# EAGLE design Main (EAGLE 9.6.2)
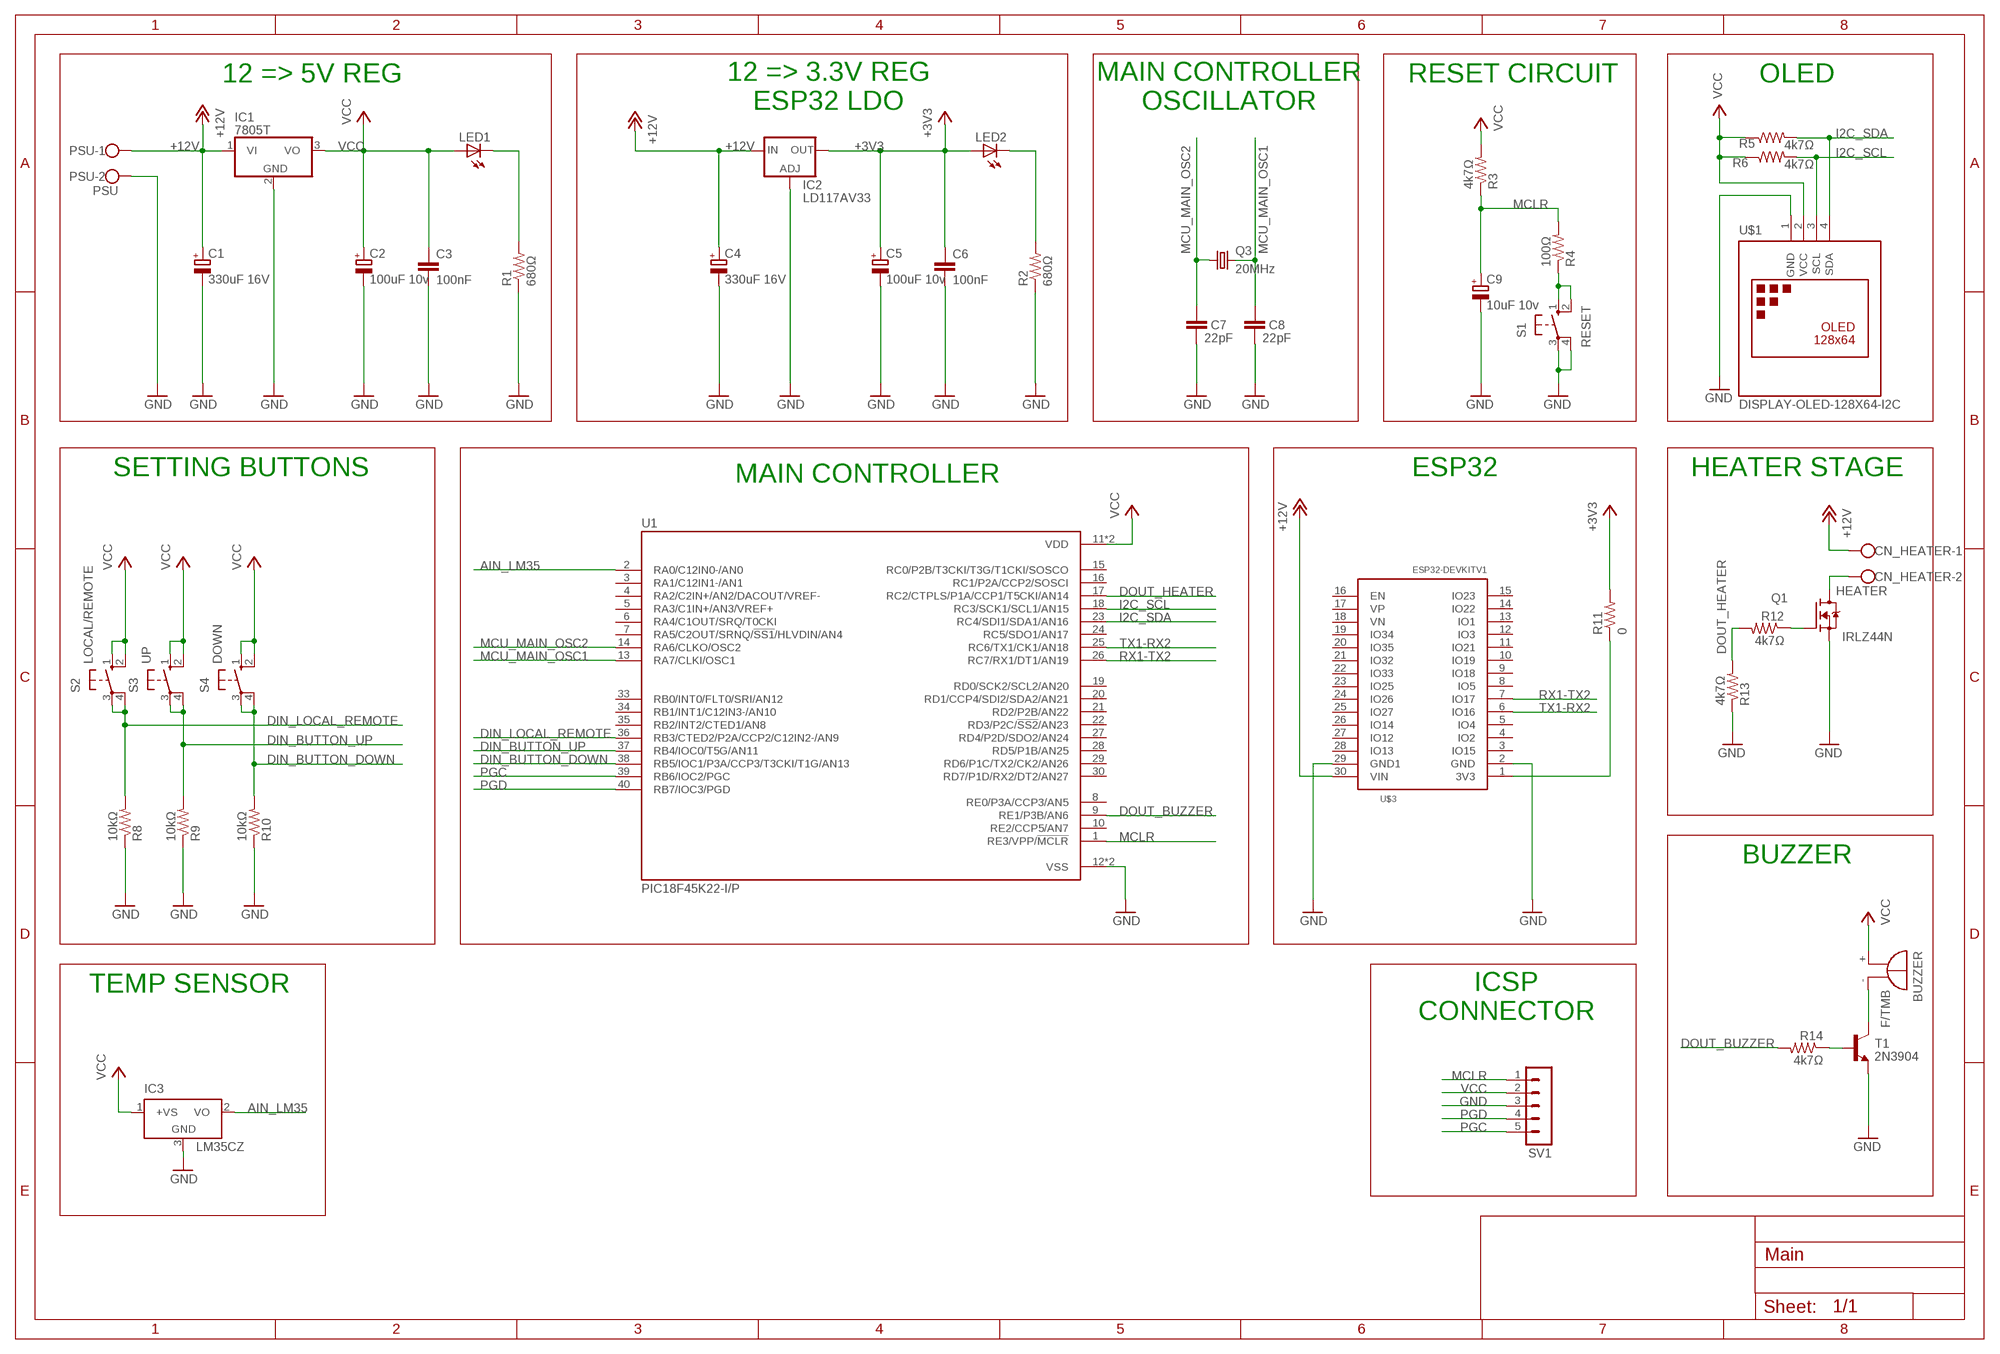
[diagram p0: schematic, sheet 1]

## Parts
BUZZER  F/TMB  [F/TMB]
C1  330uF 16V  CPOL-EUE2-5  [E2-5]
C2  100uF 10v  CPOL-EUE2-5  [E2-5]
C3  100nF  C-EU025-060X050  [C025-060X050]
C4  330uF 16V  CPOL-EUE2-5  [E2-5]
C5  100uF 10v  CPOL-EUE2-5  [E2-5]
C6  100nF  C-EU025-060X050  [C025-060X050]
C7  22pF  C-EU025-024X044  [C025-024X044]
C8  22pF  C-EU025-024X044  [C025-024X044]
C9  10uF 10v  CPOL-EUE2-5  [E2-5]
CN_HEATER  HEATER  W237-102  [W237-102]
IC1  7805T  [TO220H]
IC2  LD117AV33  [TO220L1]
IC3  LM35CZ  [TO92]
LED1  LED5MM  [LED5MM]
LED2  LED5MM  [LED5MM]
PSU  PSU  W237-102  [W237-102]
Q1  IRLZ44N  [TO254P1054X469X1930-3]
Q3  20MHz  CRYSTALHC49S  [HC49/S]
R1  680Ω  R-US_0204/7  [0204/7]
R2  680Ω  R-US_0204/7  [0204/7]
R3  4k7Ω  R-US_0204/7  [0204/7]
R4  100Ω  R-US_0204/7  [0204/7]
R5  4k7Ω  R-US_0204/7  [0204/7]
R6  4k7Ω  R-US_0204/7  [0204/7]
R8  10kΩ  R-US_0204/7  [0204/7]
R9  10kΩ  R-US_0204/7  [0204/7]
R10  10kΩ  R-US_0204/7  [0204/7]
R11  0  R-US_0204/7  [0204/7]
R12  4k7Ω  R-US_0204/7  [0204/7]
R13  4k7Ω  R-US_0204/7  [0204/7]
R14  4k7Ω  R-US_0204/7  [0204/7]
S1  RESET  10-XX  [B3F-10XX]
S2  LOCAL/REMOTE  10-XX  [B3F-10XX]
S3  UP  10-XX  [B3F-10XX]
S4  DOWN  10-XX  [B3F-10XX]
SV1  MA05-1  [MA05-1]
T1  2N3904  [TO92]
U1  PIC18F45K22-I/P  [DIP1543W47P254L5321H635Q40]
U$1  DISPLAY-OLED-128X64-I2C  [DISPLAY-OLED-128X64-I2C]
U$3  ESP32DEVKITV1  [ESP32-DEVKITV1]

## Nets
+3V3: C5.+ C6.1 IC2.2(OUT) LED2.A R11.2
+12V: C1.+ C4.+ CN_HEATER.1 IC1.1(VI) IC2.3(IN) PSU.1 U$3.30(VIN)
AIN_LM35: IC3.2(VO) U1.2(RA0/C12IN0-/AN0)
DIN_BUTTON_DOWN: R10.2 S4.3(P) S4.4(P1) U1.38(RB5/IOC1/P3A/CCP3/T3CKI/T1G/AN13)
DIN_BUTTON_UP: R9.2 S3.3(P) S3.4(P1) U1.37(RB4/IOC0/T5G/AN11)
DIN_LOCAL_REMOTE: R8.2 S2.3(P) S2.4(P1) U1.36(RB3/CTED2/P2A/CCP2/C12IN2-/AN9)
DOUT_BUZZER: R14.2 U1.9(RE1/P3B/AN6)
DOUT_HEATER: R12.2 R13.2 U1.17(RC2/CTPLS/P1A/CCP1/T5CKI/AN14)
GND: C1.- C2.- C3.2 C4.- C5.- C6.2 C7.2 C8.2 C9.- IC1.2(GND) IC2.1(ADJ) IC3.3(GND) PSU.2 Q1.3(S) R1.1 R2.1 R8.1 R9.1 R10.1 R13.1 S1.3(P) S1.4(P1) SV1.3 T1.3(E) U1.12(VSS) U1.31(VSS) U$1.1(GND) U$3.2(GND) U$3.29(GND1)
I2C_SCL: R6.2 U1.18(RC3/SCK1/SCL1/AN15) U$1.3(SCL)
I2C_SDA: R5.2 U1.23(RC4/SDI1/SDA1/AN16) U$1.4(SDA)
MCLR: C9.+ R3.1 R4.2 SV1.1 U1.1(RE3/VPP/!MCLR!)
MCU_MAIN_OSC1: C8.1 Q3.2 U1.13(RA7/CLKI/OSC1)
MCU_MAIN_OSC2: C7.1 Q3.1 U1.14(RA6/CLKO/OSC2)
N$1: LED2.K(C) R2.2
N$2: R11.1 U$3.1(3V3)
N$3: LED1.K(C) R1.2
N$6: R4.1 S1.1(S) S1.2(S1)
N$25: R14.1 T1.2(B)
N$26: BUZZER.- T1.1(C)
N$28: Q1.1(G) R12.1
N$29: CN_HEATER.2 Q1.2(D)
PGC: SV1.5 U1.39(RB6/IOC2/PGC)
PGD: SV1.4 U1.40(RB7/IOC3/PGD)
RX1-TX2: U1.26(RC7/RX1/DT1/AN19) U$3.7(IO17)
TX1-RX2: U1.25(RC6/TX1/CK1/AN18) U$3.6(IO16)
VCC: BUZZER.+ C2.+ C3.1 IC1.3(VO) IC3.1(+VS) LED1.A R3.2 R5.1 R6.1 S2.1(S) S2.2(S1) S3.1(S) S3.2(S1) S4.1(S) S4.2(S1) SV1.2 U1.11(VDD) U1.32(VDD) U$1.2(VCC)
Unconnected: U1.3(RA1/C12IN1-/AN1) U1.4(RA2/C2IN+/AN2/DACOUT/VREF-) U1.5(RA3/C1IN+/AN3/VREF+) U1.6(RA4/C1OUT/SRQ/T0CKI) U1.7(RA5/C2OUT/SRNQ/!SS1!/HLVDIN/AN4) U1.8(RE0/P3A/CCP3/AN5) U1.10(RE2/CCP5/AN7) U1.15(RC0/P2B/T3CKI/T3G/T1CKI/SOSCO) U1.16(RC1/P2A/CCP2/SOSCI) U1.19(RD0/SCK2/SCL2/AN20) U1.20(RD1/CCP4/SDI2/SDA2/AN21) U1.21(RD2/P2B/AN22) U1.22(RD3/P2C/!SS2!/AN23) U1.24(RC5/SDO1/AN17) U1.27(RD4/P2D/SDO2/AN24) U1.28(RD5/P1B/AN25) U1.29(RD6/P1C/TX2/CK2/AN26) U1.30(RD7/P1D/RX2/DT2/AN27) U1.33(RB0/INT0/FLT0/SRI/AN12) U1.34(RB1/INT1/C12IN3-/AN10) U1.35(RB2/INT2/CTED1/AN8) U$3.3(IO15) U$3.4(IO2) U$3.5(IO4) U$3.8(IO5) U$3.9(IO18) U$3.10(IO19) U$3.11(IO21) U$3.12(IO3) U$3.13(IO1) U$3.14(IO22) U$3.15(IO23) U$3.16(EN) U$3.17(VP) U$3.18(VN) U$3.19(IO34) U$3.20(IO35) U$3.21(IO32) U$3.22(IO33) U$3.23(IO25) U$3.24(IO26) U$3.25(IO27) U$3.26(IO14) U$3.27(IO12) U$3.28(IO13)

## Notes on the sheet
- 12 => 5V REG | RESET CIRCUIT | OLED
- 12 => 3.3V REG
  ESP32 LDO
- MAIN CONTROLLER
  OSCILLATOR
- SETTING BUTTONS | MAIN CONTROLLER | ESP32 | HEATER STAGE
- BUZZER
- TEMP SENSOR
- ICSP
  CONNECTOR

## Library data of the parts
BUZZER = buzzer:F/TMB: BUZZER Source: Buerklin; OC_FARNELL: unknown; OC_NEWARK: unknown
C1 C2 C4 C5 C9 = resistor:CPOL-EU: POLARIZED CAPACITOR, European symbol
C3 C6-C8 = resistor:C-EU: CAPACITOR, European symbol
CN_HEATER PSU = con-wago-500:W237-102: WAGO SCREW CLAMP; MPN: 237-102; OC_FARNELL: unknown; OC_NEWARK: 70K9898
IC1 = adafruit:78*: Positive VOLTAGE REGULATOR Added bigger pads to the TO-92 package
IC2 = v-reg:LD117A?*: Low drop fixed and adjustable positive voltage regulators 1 A Source: http://www.st.com/stonline/products/literature/ds/7194/ld1117axx.pdf
IC3 = lm35:LM35: Single-Supply Centigrade Temperature Sensor Vout = (10mV/°C x Temp °C) +5mmmV Source: http://www.national.com/ds/LM/LM35.pdf
LED1 LED2 = led:LED: LED OSRAM: - CHIPLED LG R971, LG N971, LY N971, LG Q971, LY Q971, LO R971, LY R971 LH N974, LH R974 LS Q976, LO Q976, LY Q976 LO Q996 - Hyper CHIPLED LW Q18S LB Q993, LB Q99A, LB R99A - SideLED LS A670, LO A670, LY A670, LG A670, LP A670 LB A673, LV A673, LT A673, LW A673 LH A674 LY A675 LS A676, LA A676, LO A676, LY A676, LW A676 LS A679, LY A679, LG A679 - Hyper Micro SIDELED® LS Y876, LA Y876, LO Y876, LY Y876 LT Y87S - SmartLED LW L88C, LW L88S LB L89C, LB L89S, LG L890 LS L89K, LO L89K, LY L89K LS L896, LA L896, LO L896, LY L896 - TOPLED LS T670, LO T670, LY T670, LG T670, LP T670 LSG T670, LSP T670, LSY T670, LOP T670, LYG T670 LG T671, LOG T671, LSG T671 LB T673, LV T673, LT T673, LW T673 LH T674 LS T676, LA T676, LO T676, LY T676, LB T676, LH T676, LSB T676, LW T676 LB T67C, LV T67C, LT T67C, LS T67K, LO T67K, LY T67K, LW E67C LS E67B, LA E67B, LO E67B, LY E67B, LB E67C, LV E67C, LT E67C LW T67C LS T679, LY T679, LG T679 LS T770, LO T770, LY T770, LG T770, LP T770 LB T773, LV T773, LT T773, LW T773 LH T774 LS E675, LA E675, LY E675, LS T675 LS T776, LA T776, LO T776, LY T776, LB T776 LHGB T686 LT T68C, LB T68C - Hyper Mini TOPLED® LB M676 - Mini TOPLED Santana® LG M470 LS M47K, LO M47K, LY M47K Source: http://www.osram.convergy.de LUXEON: - LUMILED® LXK2-PW12-R00, LXK2-PW12-S00, LXK2-PW14-U00, LXK2-PW14-V00 LXK2-PM12-R00, LXK2-PM12-S00, LXK2-PM14-U00 LXK2-PE12-Q00, LXK2-PE12-R00, LXK2-PE12-S00, LXK2-PE14-T00, LXK2-PE14-U00 LXK2-PB12-K00, LXK2-PB12-L00, LXK2-PB12-M00, LXK2-PB14-N00, LXK2-PB14-P00, LXK2-PB14-Q00 LXK2-PR12-L00, LXK2-PR12-M00, LXK2-PR14-Q00, LXK2-PR14-R00 LXK2-PD12-Q00, LXK2-PD12-R00, LXK2-PD12-S00 LXK2-PH12-R00, LXK2-PH12-S00 LXK2-PL12-P00, LXK2-PL12-Q00, LXK2-PL12-R00 Source: www.luxeon.com KINGBRIGHT: KA-3528ASYC Source: www.kingbright.com
Q1 = IRLZ44N:IRLZ44N: 55V Single N-Channel HEXFET Power MOSFET in a TO-220AB package Check availability <https://pricing.snapeda.com/parts/IRLZ44N/Infineon%20/%20IR/view-part?ref=eda>; AVAILABILITY: In Stock; CHECK_PRICES: https://www.snapeda.com/parts/IRLZ44N/Infineon/view-part/?ref=eda; DESCRIPTION: N-Channel 55 V 47A (Tc) 3.8W (Ta), 110W (Tc) Surface Mount D2PAK; MF: Infineon / IR; MP: IRLZ44N; PACKAGE: TO-220-3 Infineon / IR; PRICE: None; PURCHASE-URL: https://www.snapeda.com/api/url_track_click_mouser/?unipart_id=4479377&manufacturer=Infineon / IR&part_name=IRLZ44N&search_term=None; SNAPEDA_LINK: https://www.snapeda.com/parts/IRLZ44N/Infineon/view-part/?ref=snap
Q3 = crystal:CRYSTAL: CRYSTAL; OC_FARNELL: 1667008; OC_NEWARK: unknown
R1-R6 R8-R14 = resistor:R-US_: RESISTOR, American symbol
S1-S4 = switch-omron:10-XX: OMRON SWITCH; MPN: B3F-1000; OC_FARNELL: 176432; OC_NEWARK: 36M3542
SV1 = con-lstb:MA05-1: PIN HEADER; OC_FARNELL: unknown; OC_NEWARK: unknown
T1 = transistor:2N3904: NPN TRANSISTOR
U1 = PIC18F45K22-I_P:PIC18F45K22-I/P: Check availability <https://pricing.snapeda.com/parts/PIC18F45K22-I/P/Microchip/view-part?ref=eda>; AVAILABILITY: In Stock; CHECK_PRICES: https://www.snapeda.com/parts/PIC18F45K22-I/P/Microchip/view-part/?ref=eda; DESCRIPTION: PDIP-40 .600in TUBE, 32KB, Flash, 1536bytes-RAM,8-Bit nanoWatt XLP | Microchip Technology Inc. PIC18F45K22-I/P; MF: Microchip; MP: PIC18F45K22-I/P; PACKAGE: DIP-40 Microchip; PRICE: None; PURCHASE-URL: https://www.snapeda.com/api/url_track_click_mouser/?unipart_id=228946&manufacturer=Microchip&part_name=PIC18F45K22-I/P&search_term=None; SNAPEDA_LINK: https://www.snapeda.com/parts/PIC18F45K22-I/P/Microchip/view-part/?ref=snap
U$1 = diy-modules (2):DISPLAY-OLED-128X64-I2C: 128x64 Dot Matrix OLED Module based on SSD1306 chip Variant with I2C interface More details available here: http://www.instructables.com/id/Monochrome-096-i2c-OLED-display-with-arduino-SSD13/ SSD1306 datasheet: https://cdn-shop.adafruit.com/datasheets/SSD1306.pdf Click here to find device on ebay.com <http://www.ebay.com/sch/oled+display+128x64+iic> Note: There are two variants: I2C and SPI. Search for the proper version.
U$3 = ESP32-DEVKITV1:ESP32DEVKITV1

## Board
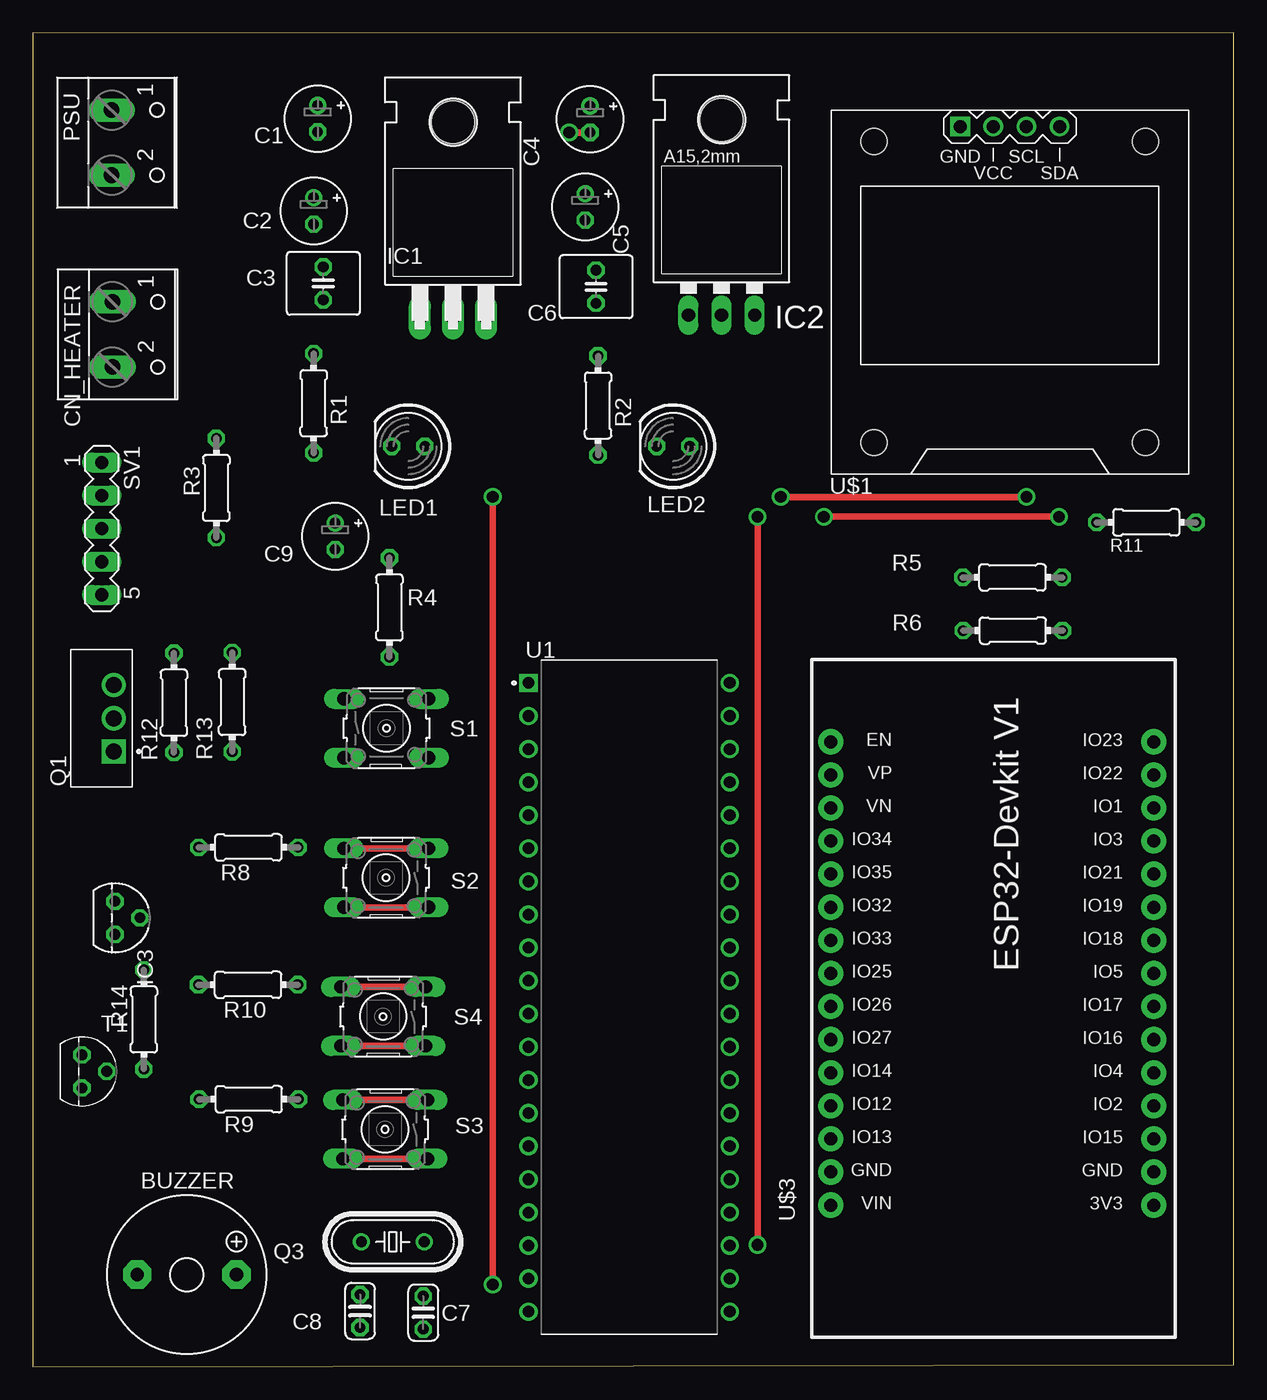
[diagram p1: board, top side]
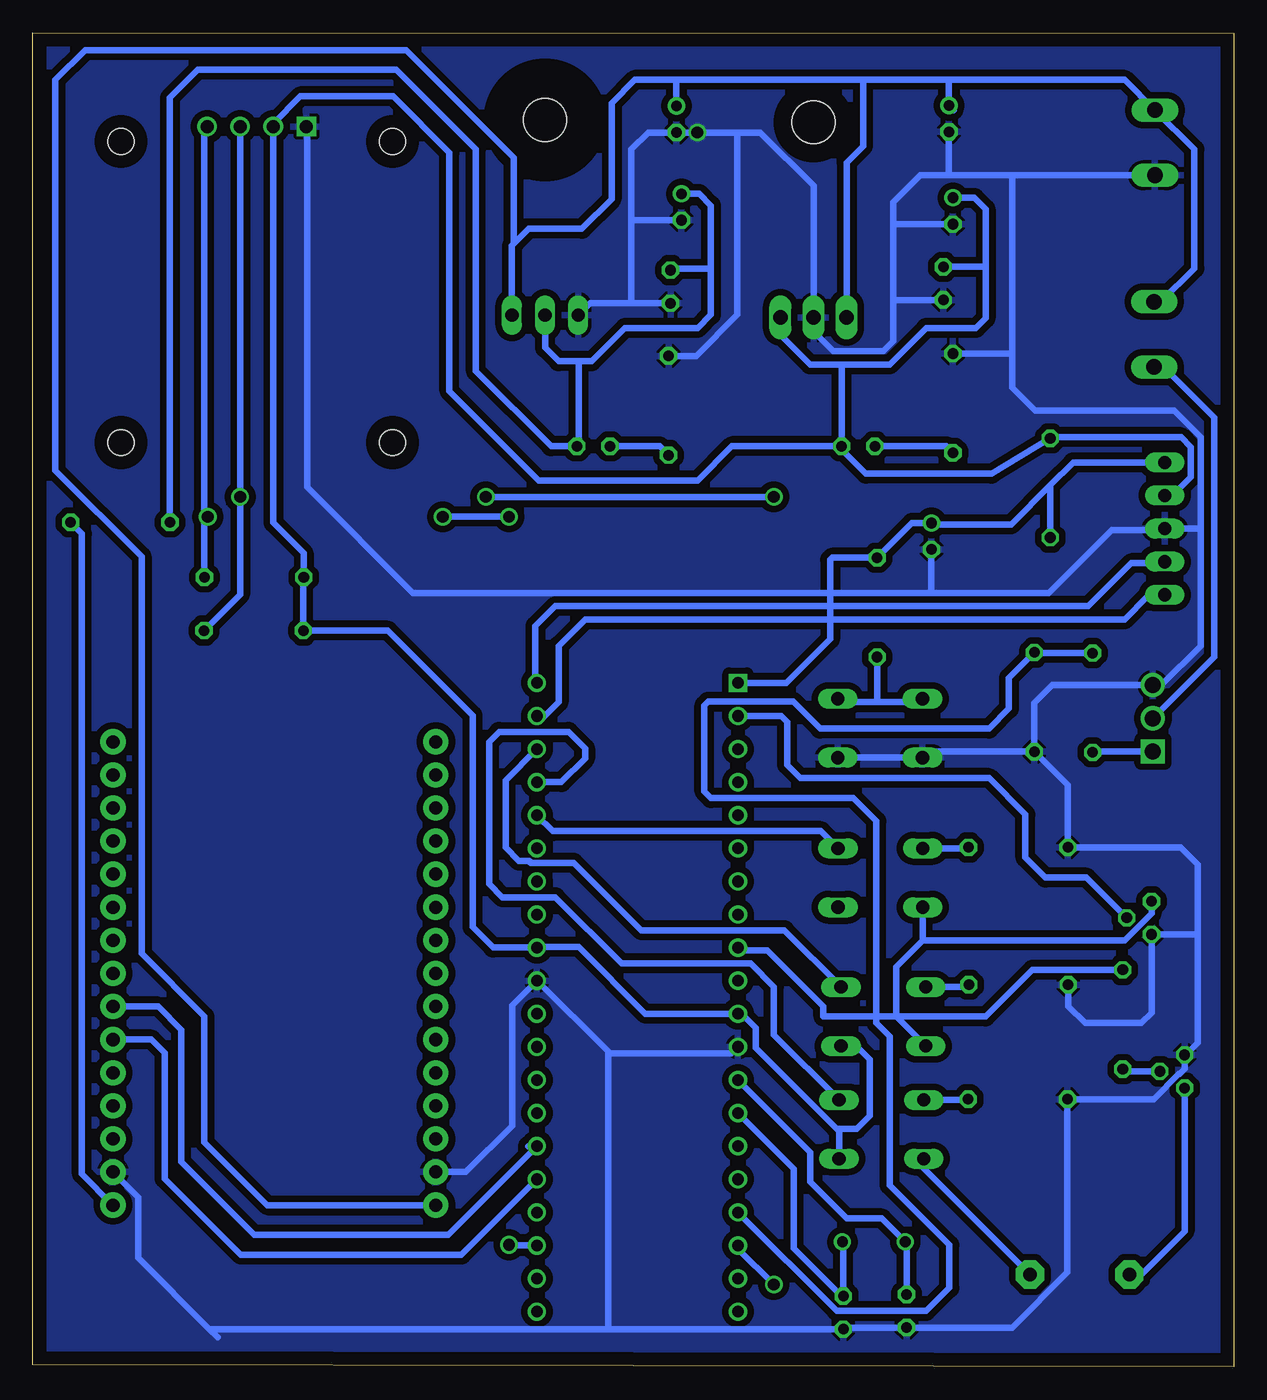
[diagram p2: board, bottom side, seen from below]

Size 92.18 x 102.41 mm. Coordinates in mm from the lower left corner, seen from the top.
Outline: 0,102.36 0,0 92.18,0.15 92.15,102.41 0,102.36
Copper layers (1*16): Top 0.035mm / dielectric 1.5mm / Bottom 0.035mm
Design rules "default": minimum track width 6mil, minimum drill 0.35mm, track to track 6mil, track to pad 6mil, pad to pad 6mil, via to via 6mil, smd to smd 6mil, copper to edge 40mil, drill to drill 6mil, minimum pad ring 10mil, minimum via ring 8mil, stop-mask expansion 4mil, vias tented up to drill 0mil, thermal gap 10mil

### Footprints (pad centres in the part's own frame; a part is rotated, then mirrored left to right if it is on the bottom)
F/TMB = drill 1.016 pad 2.159 octagon: + 3.81,0; - -3.81,0
E2-5 = drill 0.813 pad 1.27: + -1.016,0 | drill 0.813 pad 1.27 octagon: - 1.016,0
C025-060X050 = drill 0.813 octagon: 1 -1.27,0; 2 1.27,0
C025-024X044 = drill 0.813 octagon: 1 -1.27,0; 2 1.27,0
W237-102 = drill 1.194 long: 1 -2.5,-1.27; 2 2.5,-1.27
TO220H = drill 1.118 long: 1 -2.54,-10.16; 2 0,-10.16; 3 2.54,-10.16 | hole 3.302: 0,4.826
TO220L1 = drill 1.016 long: 1 -2.54,-3.81; 2 0,-3.81; 3 2.54,-3.81 | hole 3.302: 0,11.176
TO92 = drill 0.813 octagon: 1 -1.27,0; 2 0,1.905; 3 1.27,0
LED5MM = drill 0.813 octagon: A -1.27,0; K 1.27,0
TO254P1054X469X1930-3 = drill 1.23 pad 1.85 square: 1 -2.54,-0.94 | drill 1.23 pad 1.85: 2 0,-0.94; 3 2.54,-0.94
HC49/S = drill 0.813: 1 -2.413,0; 2 2.413,0
0204/7 = drill 0.813 octagon: 1 -3.81,0; 2 3.81,0
B3F-10XX = drill 1.016 long: 1 -3.251,2.261; 2 3.251,2.261; 3 -3.251,-2.261; 4 3.251,-2.261
MA05-1 = drill 1.016 long: 1 -5.08,0; 2 -2.54,0; 3 0,0; 4 2.54,0; 5 5.08,0
TO92' = drill 0.813 octagon: 1 1.27,0; 2 0,1.905; 3 -1.27,0
DIP1543W47P254L5321H635Q40 = drill 0.89 pad 1.24 square: 1 -7.715,24.13 | drill 0.89 pad 1.24: 2 -7.715,21.59; 3 -7.715,19.05; 4 -7.715,16.51; 5 -7.715,13.97; 6 -7.715,11.43; 7 -7.715,8.89; 8 -7.715,6.35; 9 -7.715,3.81; 10 -7.715,1.27; 11 -7.715,-1.27; 12 -7.715,-3.81; 13 -7.715,-6.35; 14 -7.715,-8.89; 15 -7.715,-11.43; 16 -7.715,-13.97; 17 -7.715,-16.51; 18 -7.715,-19.05; 19 -7.715,-21.59; 20 -7.715,-24.13; 21 7.715,-24.13; 22 7.715,-21.59; 23 7.715,-19.05; 24 7.715,-16.51; 25 7.715,-13.97; 26 7.715,-11.43; 27 7.715,-8.89; 28 7.715,-6.35; 29 7.715,-3.81; 30 7.715,-1.27; 31 7.715,1.27; 32 7.715,3.81; 33 7.715,6.35; 34 7.715,8.89; 35 7.715,11.43; 36 7.715,13.97; 37 7.715,16.51; 38 7.715,19.05; 39 7.715,21.59; 40 7.715,24.13
DISPLAY-OLED-128X64-I2C = drill 1 square: 1 -3.81,12.7 | drill 1: 2 -1.27,12.7; 3 1.27,12.7; 4 3.81,12.7 | hole 2: -10.414,11.557; 10.414,11.557; 10.414,-11.557; -10.414,-11.557
ESP32-DEVKITV1 = drill 1 pad 1.93: 1 -22.87,-13.54; 2 -20.33,-13.54; 3 -17.79,-13.54; 4 -15.25,-13.54; 5 -12.71,-13.54; 6 -10.17,-13.54; 7 -7.63,-13.54; 8 -5.09,-13.54; 9 -2.55,-13.54; 10 -0.01,-13.54; 11 2.53,-13.54; 12 5.07,-13.54; 13 7.61,-13.54; 14 10.15,-13.54; 15 12.69,-13.54; 16 12.69,11.23; 17 10.15,11.23; 18 7.61,11.23; 19 5.07,11.23; 20 2.53,11.23; 21 -0.01,11.23; 22 -2.55,11.23; 23 -5.09,11.23; 24 -7.63,11.23; 25 -10.17,11.23; 26 -12.71,11.23; 27 -15.25,11.23; 28 -17.79,11.23; 29 -20.33,11.23; 30 -22.87,11.23

### Placement (x,y rotation side)
BUZZER  11.84,7.09 0 top
C1  21.87,95.81 270 top
C2  21.56,88.72 270 top
C3  22.3,83.16 270 top
C4  42.77,95.76 270 top
C5  42.39,89.03 270 top
C6  43.23,82.91 270 top
C7  29.97,4.17 270 top
C8  25.12,4.29 270 top
C9  23.22,63.75 270 top
CN_HEATER  7.39,79.25 270 top
IC1  32.26,90.7 0 top
IC2  52.86,84.53 0 top
IC3  6.32,34.47 270 top
LED1  28.83,70.66 180 top
LED2  49.15,70.66 180 top
PSU  7.34,93.97 270 top
Q1  5.28,49.78 90 top
Q3  27.64,9.6 180 top
R1  21.56,73.96 270 top
R2  43.38,73.79 270 top
R3  14.1,67.46 90 top
R4  27.38,58.29 90 top
R5  75.18,60.6 0 top
R6  75.21,56.52 0 top
R8  16.56,39.88 0 top
R9  16.59,20.55 0 top
R10  16.54,29.34 0 top
R11  85.45,64.82 180 top
R12  10.85,50.98 90 top
R13  15.32,51.03 90 top
R14  8.53,26.67 90 top
S1  27.15,49.02 0 top
S2  27.13,37.54 180 top
S3  27.05,18.24 180 top
S4  26.9,26.9 180 top
SV1  5.31,64.34 270 top
T1  2N3904  [TO92']  3.78,22.68 270 top
U1  45.77,28.37 0 top
U$1  74.98,82.5 0 top
U$3  72.47,35.29 90 top

### Tracks (layer width: path | path; a pad name or v marks a point on that pad's centre or on a via)
+3V3
  Bottom 0.508: C5.+ 41.05,90.04 40.13,89.13 40.13,84.3 | 50.29,77.19 49.28,77.19 46.74,79.73 41.15,79.73 40.13,80.75 40.13,84.3 | 50.29,77.19 51.82,77.19 52.86,78.23 IC2.2 | 50.29,77.19 50.29,70.79 LED2.A 52.4,70.66 58.17,76.43 58.17,93.45 64.26,99.54 79.5,99.54 81.64,97.41 R11.2 | C6.1 43.1,84.3 40.13,84.3
+12V  (via drill 0.9 pad 0.9)
  Top 0.508: PSU.1 5.31,96.47
  Bottom 0.508: 21.51,96.47 C1.+ 21.87,98.76 21.84,98.78 | IC1.1 29.72,92.43 28.45,93.7 28.45,98.78 | 55.24,86.21 54.1,87.35 50.04,87.35 47.75,89.64 47.75,97 45.97,98.78 42.67,98.78 | 55.24,86.21 55.4,86.06 IC2.3 | 21.84,98.78 8.39,98.78 PSU.1 3.05,93.45 3.05,84.3 5.6,81.75 CN_HEATER.1 6.35,81.98 | 21.84,98.78 28.45,98.78 | 28.45,98.78 42.67,98.78 | C4.+ 42.77,98.68 42.67,98.78 | 55.24,86.21 55.24,92.81 63.5,101.07 88.14,101.07 90.42,98.78 90.42,68.81 83.82,62.2 83.82,31.72 78.99,26.9 78.99,17.25 74.17,12.42 U$3.30
  other vias: 6.07,96.47
AIN_LM35
  Bottom 0.508: IC3.2 11.33,37.57 14.48,37.57 16,39.09 16,42.39 18.8,45.19 33.27,45.19 34.29,46.2 34.29,49.5 34.75,49.96 U1.2
DIN_BUTTON_DOWN
  Top 0.508: S4.4 S4.3
  Bottom 0.508: S4.4 20.52,29.16 R10.2 | S4.3 34.49,33.5 45.47,33.5 50.66,38.7 53.94,38.7 54.08,38.84 54.86,38.84 55.88,39.85 55.88,45.03 U1.38
DIN_BUTTON_UP
  Top 0.508: S3.4 S3.3
  Bottom 0.508: S3.4 20.45,20.5 R9.2 | S3.3 35.31,25.5 35.31,29.18 37.08,30.96 46.99,30.96 52.07,36.04 56.13,36.04 57.15,37.06 57.15,47.98 56.39,48.74 51.05,48.74 49.78,47.47 49.78,46.71 51.61,44.88 U1.37
DIN_LOCAL_REMOTE
  Top 0.508: S2.4 S2.3
  Bottom 0.508: S2.4 20.45,39.8 R8.2 | S2.3 31.7,41.12 52.27,41.12 U1.36
DOUT_BUZZER
  Bottom 0.508: R14.2 15.47,30.48 19.05,26.9 31.5,26.9 31.5,27.66 35.81,31.98 37.85,31.98 U1.9
DOUT_HEATER
  Bottom 0.508: R12.2 15.27,54.79 R13.2 17.27,52.88 17.27,50.52 18.8,49 31.75,49 33.82,51.07 40.35,51.07 40.64,50.77 40.64,44.17 40.13,43.66 29.21,43.66 27.43,41.88 27.43,26.39 26.42,25.37 26.42,13.94 21.84,9.37 21.84,6.07 23.62,4.29 30.49,4.29 U1.17
GND  (via drill 0.9 pad 0.9)
  Top 0.508: v41.17,94.74 C4.-
  Bottom 0.508: PSU.2 17.02,91.47 | 17.02,91.47 21.84,91.47 | 21.84,91.47 24.08,91.47 26.16,89.38 26.16,87.6 | 26.16,87.6 26.16,82.02 | 26.16,82.02 26.16,78.71 26.92,77.95 30.73,77.95 32.26,79.48 IC1.2 32.26,90.65 36.35,94.74 38.1,94.74 | C2.- 26.06,87.71 26.16,87.6 | C3.2 26.04,81.89 26.16,82.02 | C1.- 21.87,91.49 21.84,91.47 | 38.1,94.74 v41.17,94.74 C4.- 42.8,94.72 44.96,94.72 46.23,93.45 46.23,88.11 | C5.- 46.13,88.01 46.23,88.11 | C6.2 46.23,81.64 | 46.23,81.64 49.4,81.64 IC2.1 | 46.23,88.11 46.23,81.64 | R1.1 17.2,77.77 17.02,77.95 | 17.02,77.95 17.02,91.47 | R2.1 41.25,77.6 38.1,80.75 38.1,94.74 | 23.37,59.41 14.22,59.41 9.4,64.24 5.41,64.24 SV1.3 2.69,64.34 2.54,64.49 | U$3.29 58.93,14.96 55.37,18.52 55.37,27.76 U1.31 53.45,29.64 48.01,24.2 | U$3.2 84.07,13.03 84.07,8.36 78.61,2.9 | 78.61,2.9 77.98,2.26 | U$1.1 71.12,95.15 71.12,67.54 62.99,59.41 23.37,59.41 | 2.54,64.49 2.54,55.35 5.56,52.32 Q1.3 13.95,52.32 15.32,50.95 R13.1 | 2.54,64.49 2.54,71.35 4.57,73.38 15.24,73.38 17.02,75.16 17.02,77.95 | U1.12 38.56,24.05 47.86,24.05 48.01,24.2 | 48.01,2.9 C7.2 29.84,3.02 C8.2 17.02,3.02 12.78,7.26 R9.1 6.16,20.55 4.23,22.48 4.17,22.48 3.79,22.86 T1.3 3.71,23.95 2.79,24.87 2.79,33.25 | R13.1 12.75,44.65 R8.1 4.09,39.88 2.79,38.58 2.79,33.25 | 2.79,33.25 2.85,33.2 IC3.3 6.33,27.18 7.11,26.39 11.43,26.39 12.72,27.69 R10.1 | R13.1 23.44,47.22 S1.3 S1.4 | 23.37,59.41 23.22,59.56 C9.- | 48.01,2.9 78.61,2.9 | 48.01,2.9 48.01,24.2
  pour Bottom (isolate 0.508): 1.02,101.57 91.19,101.57 91.19,96.24 91.19,1.24 1.02,1.24
I2C_SCL  (via drill 0.9 pad 0.9)
  Top 0.508: v57.4,66.78 v76.25,66.78 | v35.31,6.32 v35.31,66.78
  Bottom 0.508: U$1.3 v76.25,66.78 76.25,59.28 R6.2 | v35.31,6.32 38.06,9.07 U1.18 | v57.4,66.78 v35.31,66.78
I2C_SDA  (via drill 0.9 pad 0.9)
  Top 0.508: v55.63,9.37 v55.63,65.25 | v60.71,65.25 v78.74,65.25
  Bottom 0.508: R5.2 78.99,65 | 78.99,65 78.99,95 U$1.4 | U1.23 55.58,9.32 v55.63,9.37 | v55.63,65.25 v60.71,65.25 | v78.74,65.25 78.99,65
MCLR
  Bottom 0.508: R3.1 14.1,67.67 | SV1.1 12.34,69.42 14.1,67.67 | 14.1,67.67 17.09,64.67 23.11,64.67 C9.+ 24.71,64.77 R4.2 30.84,62.1 30.99,61.95 30.99,55.85 34.34,52.5 U1.1
MCU_MAIN_OSC1
  Bottom 0.508: U1.13 32.51,16.48 32.51,14.2 29.72,11.4 27.03,11.4 Q3.2 25.12,9.5 C8.1
MCU_MAIN_OSC2
  Bottom 0.508: U1.14 33.78,15.21 33.78,9.12 30.1,5.44 C7.1 29.97,9.52 Q3.1
N$1
  Bottom 0.508: LED2.K 44.07,70.66 R2.2
N$2
  Bottom 0.508: U$3.1 88.39,14.8 88.39,63.96 R11.1
N$3
  Bottom 0.508: LED1.K 22.07,70.66 R1.2
N$6
  Bottom 0.508: 30.4,51.46 S1.2 30.15,51.03 27.18,51.03 | R4.1 27.38,51.23 27.18,51.03 | 27.18,51.03 24.16,51.03 S1.1
N$25
  Bottom 0.508: T1.2 8.36,22.68 R14.1
N$26
  Bottom 0.508: T1.1 3.79,10.41 7.11,7.09 BUZZER.-
N$28
  Bottom 0.508: Q1.1 10.77,47.24 R12.1
N$29
  Bottom 0.508: Q1.2 1.52,54.48 1.52,72.87 5.4,76.75 CN_HEATER.2
PGC
  Bottom 0.508: SV1.5 5.41,59.16 6.6,59.16 8.38,57.38 49.78,57.38 51.82,55.35 51.82,51.03 52.88,49.96 U1.39
PGD
  Bottom 0.508: SV1.4 5.41,61.7 7.87,61.7 11.18,58.39 52.07,58.39 53.59,56.87 53.59,52.61 U1.40
RX1-TX2
  Bottom 0.508: 54.15,16.94 U1.26 60.29,10.13 75.18,10.13 80.77,15.72 80.77,25.88 82.55,27.66 U$3.7
TX1-RX2
  Bottom 0.508: U1.25 59.28,8.61 76.2,8.61 82.04,14.45 82.04,24.1 83.06,25.12 U$3.6
VCC
  Top 0.508: S2.2 S2.1 | S4.2 S4.1 | S3.2 S3.1
  Bottom 0.254: 30.23,70.54 LED1.A
  Bottom 0.508: C2.+ 19.91,89.74 19.05,88.87 19.05,84.56 | 19.05,84.56 19.05,80.49 19.81,79.73 23.62,79.73 26.42,76.94 30.23,76.94 | IC1.3 34.8,79.22 32.51,76.94 30.23,76.94 | C3.1 19.18,84.43 19.05,84.56 | 30.23,76.94 30.1,76.81 LED1.A 38.53,70.66 41.15,68.05 53.34,68.05 60.2,74.9 60.2,93.19 64.52,97.51 71.63,97.51 73.71,95.43 U$1.2 73.71,64.8 71.37,62.46 R5.1 71.4,60.58 R6.1 64.92,56.51 58.42,50.01 58.42,33.76 56.84,32.18 53.85,32.18 | 5.41,66.78 SV1.2 4.72,66.88 3.3,68.3 3.3,70.59 4.06,71.35 14.02,71.35 R3.2 18.59,68.55 28.25,68.55 30.23,70.54 | U1.32 53.85,32.18 | 53.85,32.18 53.8,32.23 50.29,32.23 45.16,27.1 U1.11 37.76,27.1 36.7,26.04 36.7,24.48 30.48,18.26 30.23,18.26 | IC3.1 6.33,34.8 8.38,32.74 23.88,32.74 | S3.2 23.8,15.24 BUZZER.+ | S4.2 25.91,26.9 25.91,30.71 23.88,32.74 | 30.23,18.26 28.96,18.26 27.94,19.28 27.94,23.6 28.98,24.64 S4.1 | S3.1 30.3,18.19 30.23,18.26 | 23.88,32.74 S2.2